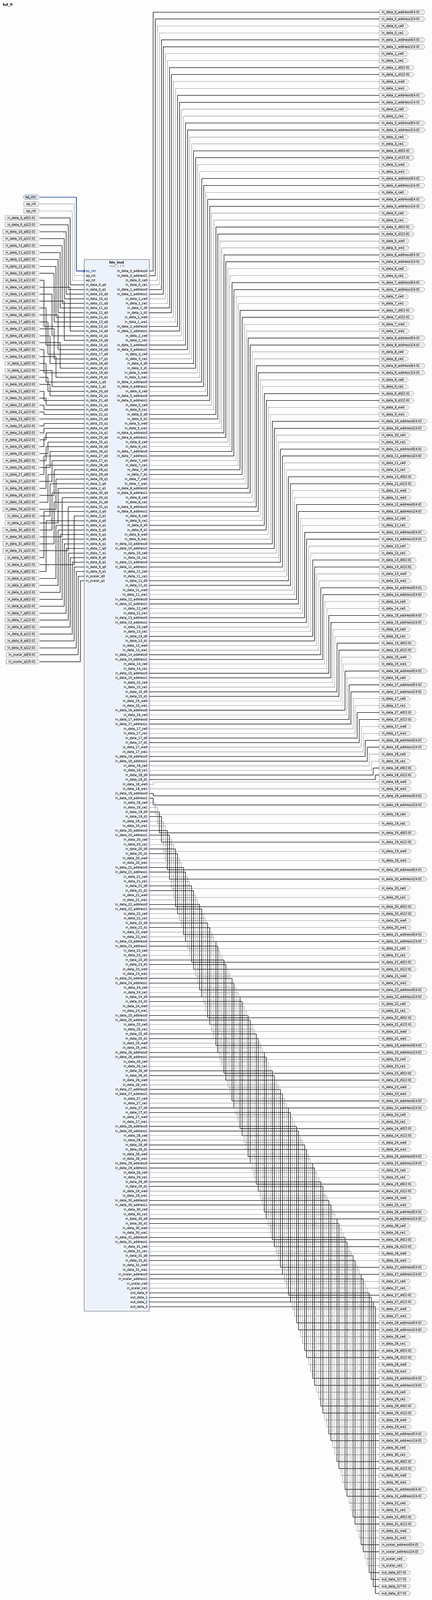
[diagram p0: block diagram of the top level, whole]
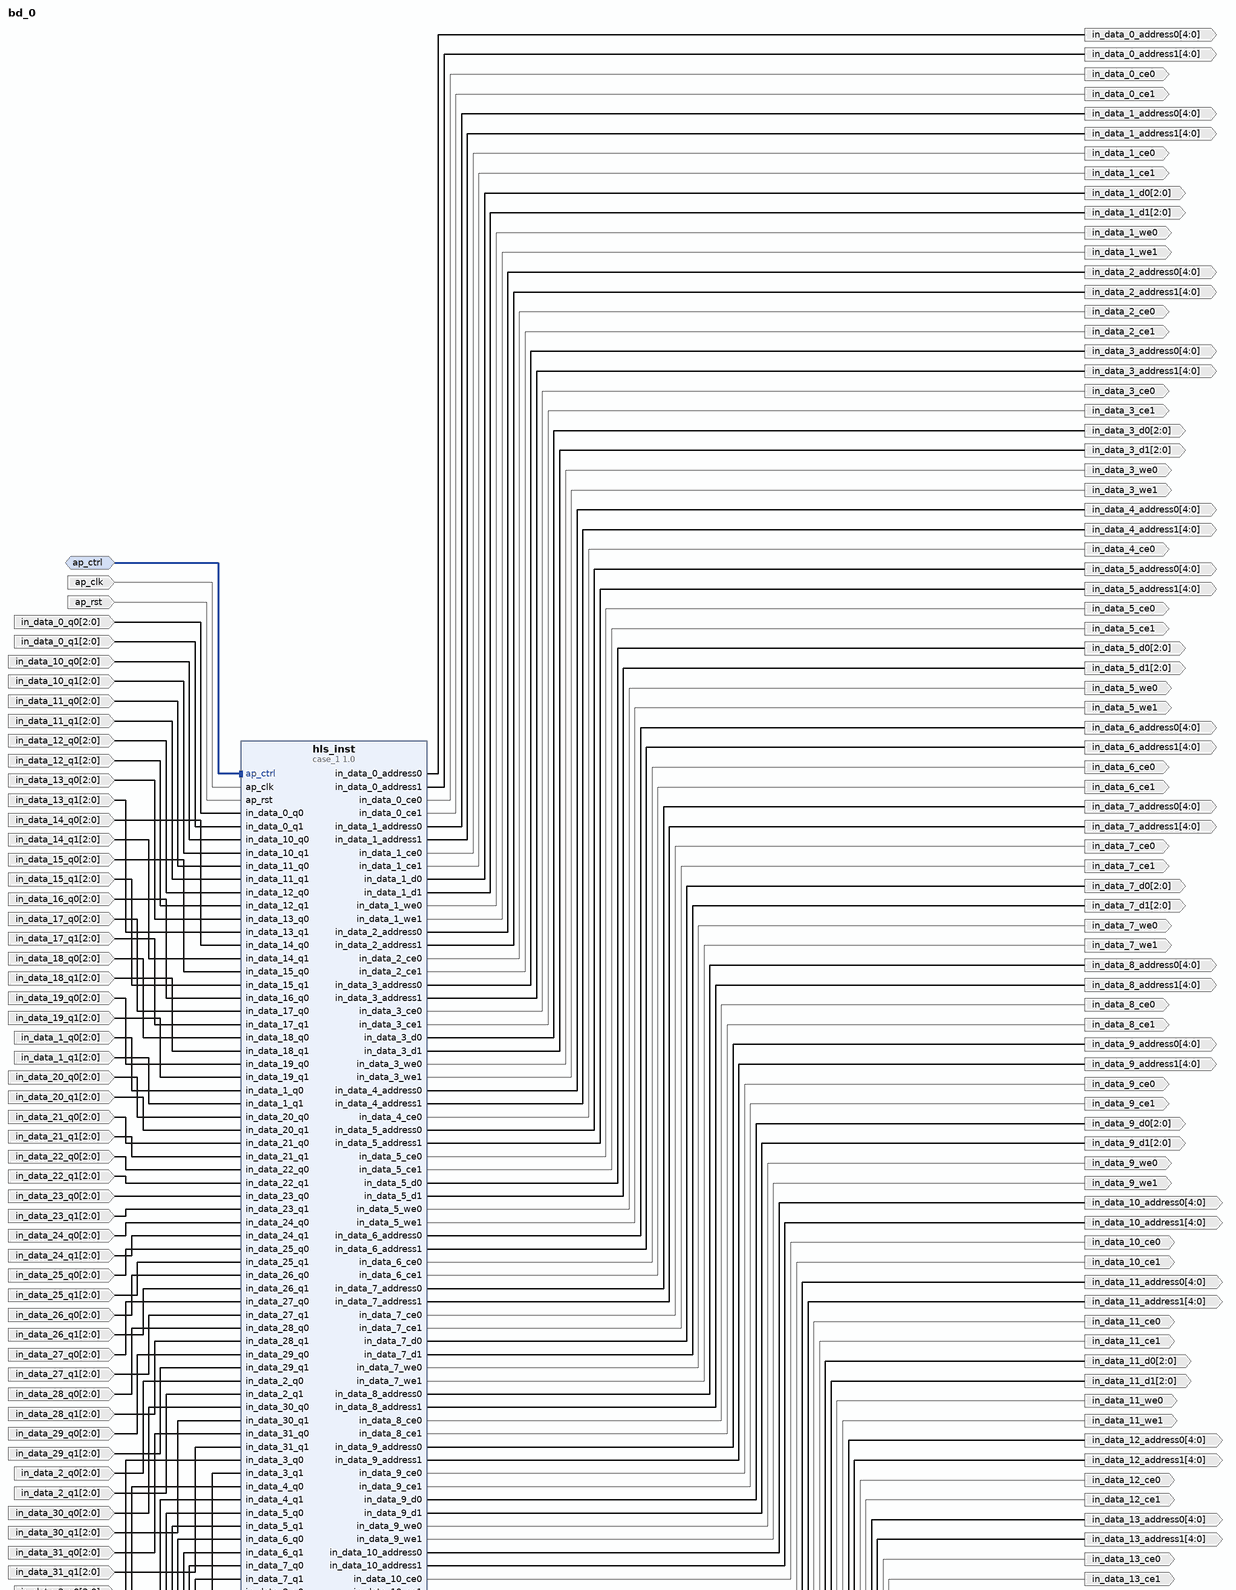
[diagram p1: block diagram of the top level, upper part]
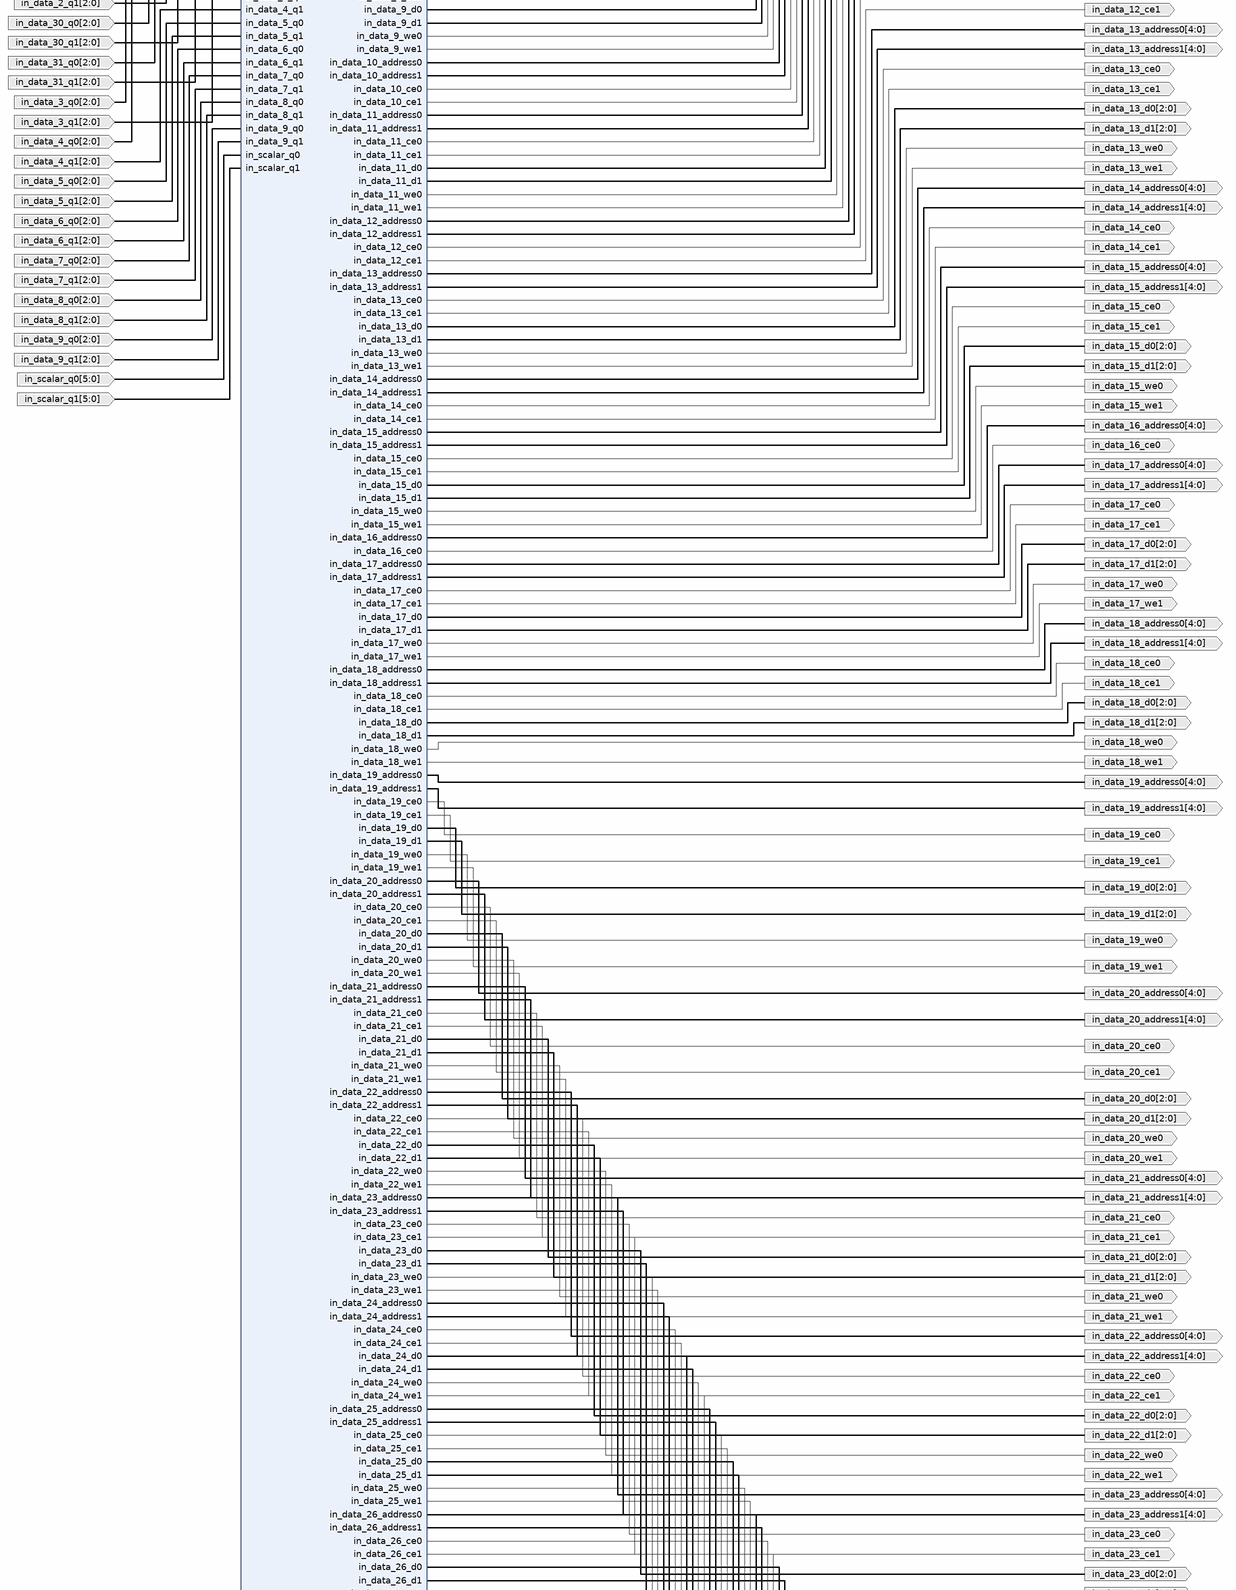
[diagram p2: block diagram of the top level, middle part]
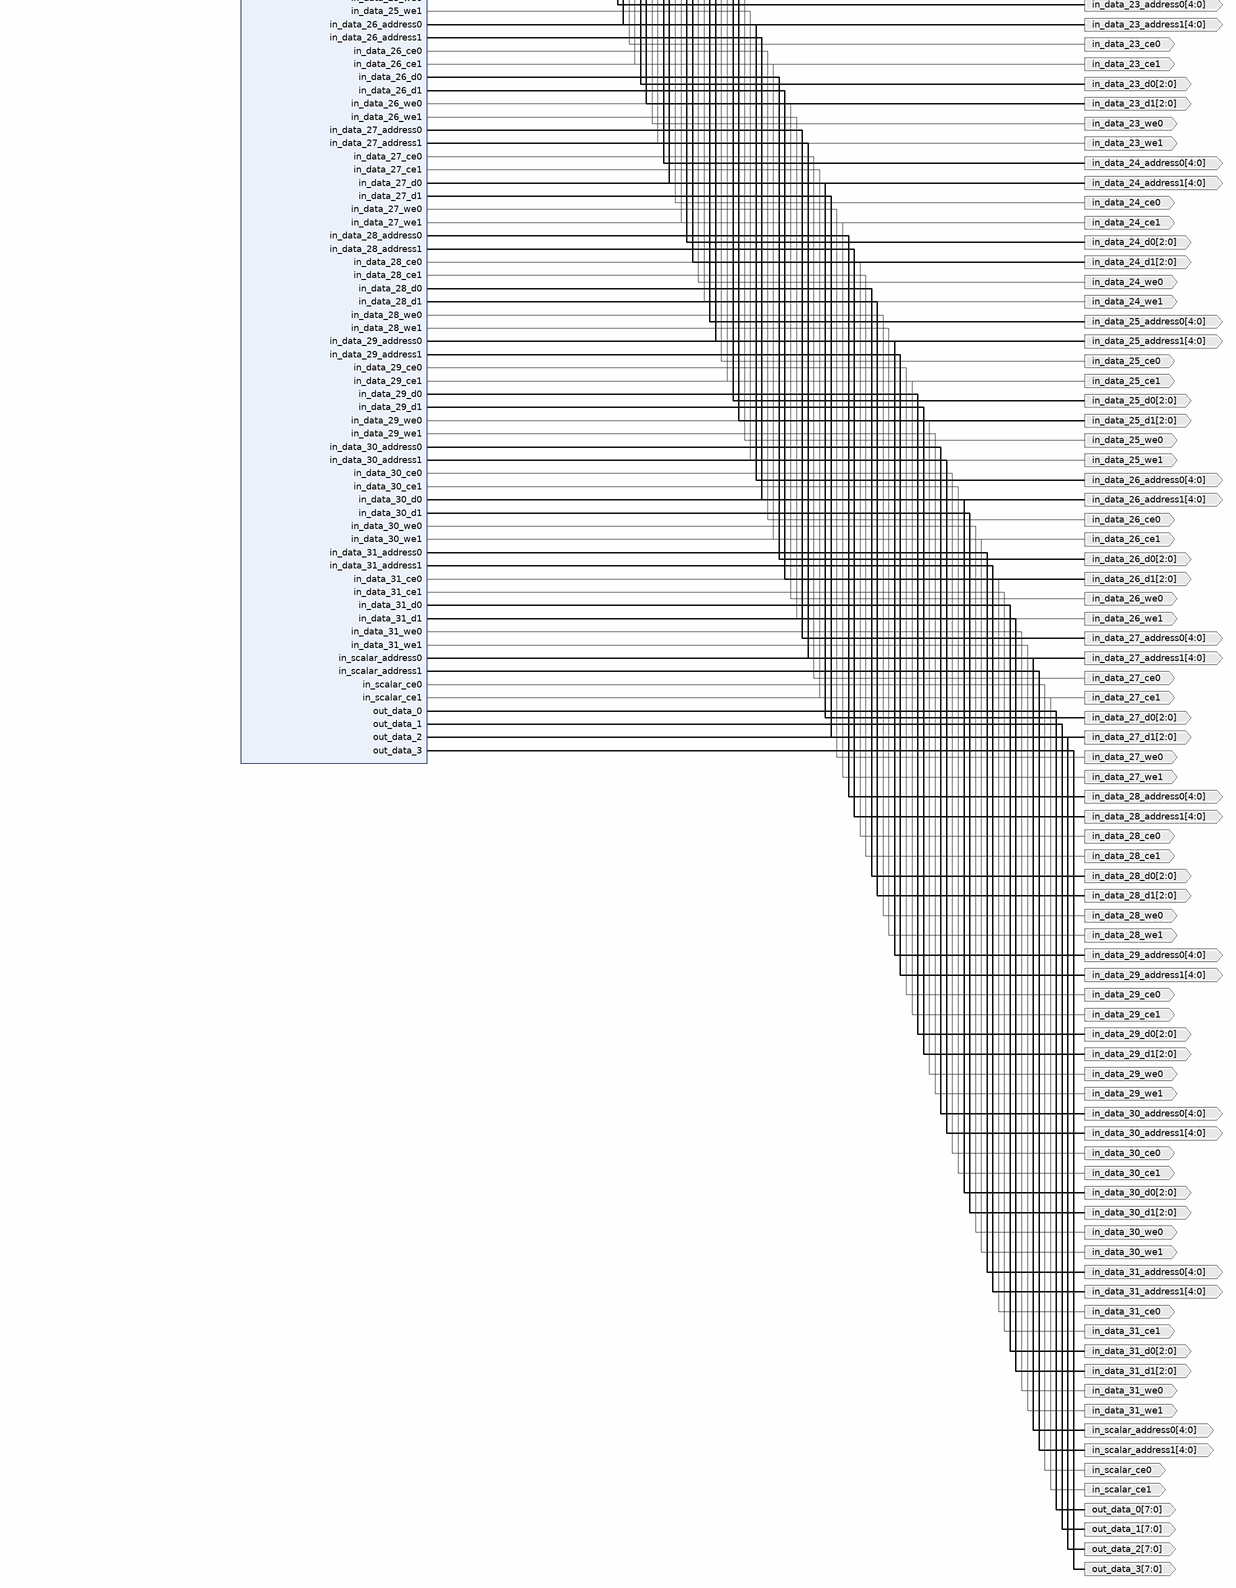
[diagram p3: block diagram of the top level, lower part]
# Vivado block design bd_0, xc7z020clg400-1, Vivado 2025.1
create_bd_design bd_0

create_bd_intf_port -mode Slave -vlnv xilinx.com:interface:acc_handshake_rtl:1.0 ap_ctrl
create_bd_port -dir I -type clk ap_clk
set_property -dict {CONFIG.FREQ_HZ 83000000.0} [get_bd_ports ap_clk]
create_bd_port -dir I -type rst ap_rst
set_property -dict {CONFIG.POLARITY ACTIVE_HIGH} [get_bd_ports ap_rst]
create_bd_port -dir O -from 4 -to 0 -type data in_data_0_address0
create_bd_port -dir O -from 4 -to 0 -type data in_data_0_address1
create_bd_port -dir O in_data_0_ce0
create_bd_port -dir O in_data_0_ce1
create_bd_port -dir I -from 2 -to 0 -type data in_data_0_q0
create_bd_port -dir I -from 2 -to 0 -type data in_data_0_q1
create_bd_port -dir O -from 4 -to 0 -type data in_data_10_address0
create_bd_port -dir O -from 4 -to 0 -type data in_data_10_address1
create_bd_port -dir O in_data_10_ce0
create_bd_port -dir O in_data_10_ce1
create_bd_port -dir I -from 2 -to 0 -type data in_data_10_q0
create_bd_port -dir I -from 2 -to 0 -type data in_data_10_q1
create_bd_port -dir O -from 4 -to 0 -type data in_data_11_address0
create_bd_port -dir O -from 4 -to 0 -type data in_data_11_address1
create_bd_port -dir O in_data_11_ce0
create_bd_port -dir O in_data_11_ce1
create_bd_port -dir O -from 2 -to 0 -type data in_data_11_d0
create_bd_port -dir O -from 2 -to 0 -type data in_data_11_d1
create_bd_port -dir I -from 2 -to 0 -type data in_data_11_q0
create_bd_port -dir I -from 2 -to 0 -type data in_data_11_q1
create_bd_port -dir O in_data_11_we0
create_bd_port -dir O in_data_11_we1
create_bd_port -dir O -from 4 -to 0 -type data in_data_12_address0
create_bd_port -dir O -from 4 -to 0 -type data in_data_12_address1
create_bd_port -dir O in_data_12_ce0
create_bd_port -dir O in_data_12_ce1
create_bd_port -dir I -from 2 -to 0 -type data in_data_12_q0
create_bd_port -dir I -from 2 -to 0 -type data in_data_12_q1
create_bd_port -dir O -from 4 -to 0 -type data in_data_13_address0
create_bd_port -dir O -from 4 -to 0 -type data in_data_13_address1
create_bd_port -dir O in_data_13_ce0
create_bd_port -dir O in_data_13_ce1
create_bd_port -dir O -from 2 -to 0 -type data in_data_13_d0
create_bd_port -dir O -from 2 -to 0 -type data in_data_13_d1
create_bd_port -dir I -from 2 -to 0 -type data in_data_13_q0
create_bd_port -dir I -from 2 -to 0 -type data in_data_13_q1
create_bd_port -dir O in_data_13_we0
create_bd_port -dir O in_data_13_we1
create_bd_port -dir O -from 4 -to 0 -type data in_data_14_address0
create_bd_port -dir O -from 4 -to 0 -type data in_data_14_address1
create_bd_port -dir O in_data_14_ce0
create_bd_port -dir O in_data_14_ce1
create_bd_port -dir I -from 2 -to 0 -type data in_data_14_q0
create_bd_port -dir I -from 2 -to 0 -type data in_data_14_q1
create_bd_port -dir O -from 4 -to 0 -type data in_data_15_address0
create_bd_port -dir O -from 4 -to 0 -type data in_data_15_address1
create_bd_port -dir O in_data_15_ce0
create_bd_port -dir O in_data_15_ce1
create_bd_port -dir O -from 2 -to 0 -type data in_data_15_d0
create_bd_port -dir O -from 2 -to 0 -type data in_data_15_d1
create_bd_port -dir I -from 2 -to 0 -type data in_data_15_q0
create_bd_port -dir I -from 2 -to 0 -type data in_data_15_q1
create_bd_port -dir O in_data_15_we0
create_bd_port -dir O in_data_15_we1
create_bd_port -dir O -from 4 -to 0 -type data in_data_16_address0
create_bd_port -dir O in_data_16_ce0
create_bd_port -dir I -from 2 -to 0 -type data in_data_16_q0
create_bd_port -dir O -from 4 -to 0 -type data in_data_17_address0
create_bd_port -dir O -from 4 -to 0 -type data in_data_17_address1
create_bd_port -dir O in_data_17_ce0
create_bd_port -dir O in_data_17_ce1
create_bd_port -dir O -from 2 -to 0 -type data in_data_17_d0
create_bd_port -dir O -from 2 -to 0 -type data in_data_17_d1
create_bd_port -dir I -from 2 -to 0 -type data in_data_17_q0
create_bd_port -dir I -from 2 -to 0 -type data in_data_17_q1
create_bd_port -dir O in_data_17_we0
create_bd_port -dir O in_data_17_we1
create_bd_port -dir O -from 4 -to 0 -type data in_data_18_address0
create_bd_port -dir O -from 4 -to 0 -type data in_data_18_address1
create_bd_port -dir O in_data_18_ce0
create_bd_port -dir O in_data_18_ce1
create_bd_port -dir O -from 2 -to 0 -type data in_data_18_d0
create_bd_port -dir O -from 2 -to 0 -type data in_data_18_d1
create_bd_port -dir I -from 2 -to 0 -type data in_data_18_q0
create_bd_port -dir I -from 2 -to 0 -type data in_data_18_q1
create_bd_port -dir O in_data_18_we0
create_bd_port -dir O in_data_18_we1
create_bd_port -dir O -from 4 -to 0 -type data in_data_19_address0
create_bd_port -dir O -from 4 -to 0 -type data in_data_19_address1
create_bd_port -dir O in_data_19_ce0
create_bd_port -dir O in_data_19_ce1
create_bd_port -dir O -from 2 -to 0 -type data in_data_19_d0
create_bd_port -dir O -from 2 -to 0 -type data in_data_19_d1
create_bd_port -dir I -from 2 -to 0 -type data in_data_19_q0
create_bd_port -dir I -from 2 -to 0 -type data in_data_19_q1
create_bd_port -dir O in_data_19_we0
create_bd_port -dir O in_data_19_we1
create_bd_port -dir O -from 4 -to 0 -type data in_data_1_address0
create_bd_port -dir O -from 4 -to 0 -type data in_data_1_address1
create_bd_port -dir O in_data_1_ce0
create_bd_port -dir O in_data_1_ce1
create_bd_port -dir O -from 2 -to 0 -type data in_data_1_d0
create_bd_port -dir O -from 2 -to 0 -type data in_data_1_d1
create_bd_port -dir I -from 2 -to 0 -type data in_data_1_q0
create_bd_port -dir I -from 2 -to 0 -type data in_data_1_q1
create_bd_port -dir O in_data_1_we0
create_bd_port -dir O in_data_1_we1
create_bd_port -dir O -from 4 -to 0 -type data in_data_20_address0
create_bd_port -dir O -from 4 -to 0 -type data in_data_20_address1
create_bd_port -dir O in_data_20_ce0
create_bd_port -dir O in_data_20_ce1
create_bd_port -dir O -from 2 -to 0 -type data in_data_20_d0
create_bd_port -dir O -from 2 -to 0 -type data in_data_20_d1
create_bd_port -dir I -from 2 -to 0 -type data in_data_20_q0
create_bd_port -dir I -from 2 -to 0 -type data in_data_20_q1
create_bd_port -dir O in_data_20_we0
create_bd_port -dir O in_data_20_we1
create_bd_port -dir O -from 4 -to 0 -type data in_data_21_address0
create_bd_port -dir O -from 4 -to 0 -type data in_data_21_address1
create_bd_port -dir O in_data_21_ce0
create_bd_port -dir O in_data_21_ce1
create_bd_port -dir O -from 2 -to 0 -type data in_data_21_d0
create_bd_port -dir O -from 2 -to 0 -type data in_data_21_d1
create_bd_port -dir I -from 2 -to 0 -type data in_data_21_q0
create_bd_port -dir I -from 2 -to 0 -type data in_data_21_q1
create_bd_port -dir O in_data_21_we0
create_bd_port -dir O in_data_21_we1
create_bd_port -dir O -from 4 -to 0 -type data in_data_22_address0
create_bd_port -dir O -from 4 -to 0 -type data in_data_22_address1
create_bd_port -dir O in_data_22_ce0
create_bd_port -dir O in_data_22_ce1
create_bd_port -dir O -from 2 -to 0 -type data in_data_22_d0
create_bd_port -dir O -from 2 -to 0 -type data in_data_22_d1
create_bd_port -dir I -from 2 -to 0 -type data in_data_22_q0
create_bd_port -dir I -from 2 -to 0 -type data in_data_22_q1
create_bd_port -dir O in_data_22_we0
create_bd_port -dir O in_data_22_we1
create_bd_port -dir O -from 4 -to 0 -type data in_data_23_address0
create_bd_port -dir O -from 4 -to 0 -type data in_data_23_address1
create_bd_port -dir O in_data_23_ce0
create_bd_port -dir O in_data_23_ce1
create_bd_port -dir O -from 2 -to 0 -type data in_data_23_d0
create_bd_port -dir O -from 2 -to 0 -type data in_data_23_d1
create_bd_port -dir I -from 2 -to 0 -type data in_data_23_q0
create_bd_port -dir I -from 2 -to 0 -type data in_data_23_q1
create_bd_port -dir O in_data_23_we0
create_bd_port -dir O in_data_23_we1
create_bd_port -dir O -from 4 -to 0 -type data in_data_24_address0
create_bd_port -dir O -from 4 -to 0 -type data in_data_24_address1
create_bd_port -dir O in_data_24_ce0
create_bd_port -dir O in_data_24_ce1
create_bd_port -dir O -from 2 -to 0 -type data in_data_24_d0
create_bd_port -dir O -from 2 -to 0 -type data in_data_24_d1
create_bd_port -dir I -from 2 -to 0 -type data in_data_24_q0
create_bd_port -dir I -from 2 -to 0 -type data in_data_24_q1
create_bd_port -dir O in_data_24_we0
create_bd_port -dir O in_data_24_we1
create_bd_port -dir O -from 4 -to 0 -type data in_data_25_address0
create_bd_port -dir O -from 4 -to 0 -type data in_data_25_address1
create_bd_port -dir O in_data_25_ce0
create_bd_port -dir O in_data_25_ce1
create_bd_port -dir O -from 2 -to 0 -type data in_data_25_d0
create_bd_port -dir O -from 2 -to 0 -type data in_data_25_d1
create_bd_port -dir I -from 2 -to 0 -type data in_data_25_q0
create_bd_port -dir I -from 2 -to 0 -type data in_data_25_q1
create_bd_port -dir O in_data_25_we0
create_bd_port -dir O in_data_25_we1
create_bd_port -dir O -from 4 -to 0 -type data in_data_26_address0
create_bd_port -dir O -from 4 -to 0 -type data in_data_26_address1
create_bd_port -dir O in_data_26_ce0
create_bd_port -dir O in_data_26_ce1
create_bd_port -dir O -from 2 -to 0 -type data in_data_26_d0
create_bd_port -dir O -from 2 -to 0 -type data in_data_26_d1
create_bd_port -dir I -from 2 -to 0 -type data in_data_26_q0
create_bd_port -dir I -from 2 -to 0 -type data in_data_26_q1
create_bd_port -dir O in_data_26_we0
create_bd_port -dir O in_data_26_we1
create_bd_port -dir O -from 4 -to 0 -type data in_data_27_address0
create_bd_port -dir O -from 4 -to 0 -type data in_data_27_address1
create_bd_port -dir O in_data_27_ce0
create_bd_port -dir O in_data_27_ce1
create_bd_port -dir O -from 2 -to 0 -type data in_data_27_d0
create_bd_port -dir O -from 2 -to 0 -type data in_data_27_d1
create_bd_port -dir I -from 2 -to 0 -type data in_data_27_q0
create_bd_port -dir I -from 2 -to 0 -type data in_data_27_q1
create_bd_port -dir O in_data_27_we0
create_bd_port -dir O in_data_27_we1
create_bd_port -dir O -from 4 -to 0 -type data in_data_28_address0
create_bd_port -dir O -from 4 -to 0 -type data in_data_28_address1
create_bd_port -dir O in_data_28_ce0
create_bd_port -dir O in_data_28_ce1
create_bd_port -dir O -from 2 -to 0 -type data in_data_28_d0
create_bd_port -dir O -from 2 -to 0 -type data in_data_28_d1
create_bd_port -dir I -from 2 -to 0 -type data in_data_28_q0
create_bd_port -dir I -from 2 -to 0 -type data in_data_28_q1
create_bd_port -dir O in_data_28_we0
create_bd_port -dir O in_data_28_we1
create_bd_port -dir O -from 4 -to 0 -type data in_data_29_address0
create_bd_port -dir O -from 4 -to 0 -type data in_data_29_address1
create_bd_port -dir O in_data_29_ce0
create_bd_port -dir O in_data_29_ce1
create_bd_port -dir O -from 2 -to 0 -type data in_data_29_d0
create_bd_port -dir O -from 2 -to 0 -type data in_data_29_d1
create_bd_port -dir I -from 2 -to 0 -type data in_data_29_q0
create_bd_port -dir I -from 2 -to 0 -type data in_data_29_q1
create_bd_port -dir O in_data_29_we0
create_bd_port -dir O in_data_29_we1
create_bd_port -dir O -from 4 -to 0 -type data in_data_2_address0
create_bd_port -dir O -from 4 -to 0 -type data in_data_2_address1
create_bd_port -dir O in_data_2_ce0
create_bd_port -dir O in_data_2_ce1
create_bd_port -dir I -from 2 -to 0 -type data in_data_2_q0
create_bd_port -dir I -from 2 -to 0 -type data in_data_2_q1
create_bd_port -dir O -from 4 -to 0 -type data in_data_30_address0
create_bd_port -dir O -from 4 -to 0 -type data in_data_30_address1
create_bd_port -dir O in_data_30_ce0
create_bd_port -dir O in_data_30_ce1
create_bd_port -dir O -from 2 -to 0 -type data in_data_30_d0
create_bd_port -dir O -from 2 -to 0 -type data in_data_30_d1
create_bd_port -dir I -from 2 -to 0 -type data in_data_30_q0
create_bd_port -dir I -from 2 -to 0 -type data in_data_30_q1
create_bd_port -dir O in_data_30_we0
create_bd_port -dir O in_data_30_we1
create_bd_port -dir O -from 4 -to 0 -type data in_data_31_address0
create_bd_port -dir O -from 4 -to 0 -type data in_data_31_address1
create_bd_port -dir O in_data_31_ce0
create_bd_port -dir O in_data_31_ce1
create_bd_port -dir O -from 2 -to 0 -type data in_data_31_d0
create_bd_port -dir O -from 2 -to 0 -type data in_data_31_d1
create_bd_port -dir I -from 2 -to 0 -type data in_data_31_q0
create_bd_port -dir I -from 2 -to 0 -type data in_data_31_q1
create_bd_port -dir O in_data_31_we0
create_bd_port -dir O in_data_31_we1
create_bd_port -dir O -from 4 -to 0 -type data in_data_3_address0
create_bd_port -dir O -from 4 -to 0 -type data in_data_3_address1
create_bd_port -dir O in_data_3_ce0
create_bd_port -dir O in_data_3_ce1
create_bd_port -dir O -from 2 -to 0 -type data in_data_3_d0
create_bd_port -dir O -from 2 -to 0 -type data in_data_3_d1
create_bd_port -dir I -from 2 -to 0 -type data in_data_3_q0
create_bd_port -dir I -from 2 -to 0 -type data in_data_3_q1
create_bd_port -dir O in_data_3_we0
create_bd_port -dir O in_data_3_we1
create_bd_port -dir O -from 4 -to 0 -type data in_data_4_address0
create_bd_port -dir O -from 4 -to 0 -type data in_data_4_address1
create_bd_port -dir O in_data_4_ce0
create_bd_port -dir I -from 2 -to 0 -type data in_data_4_q0
create_bd_port -dir I -from 2 -to 0 -type data in_data_4_q1
create_bd_port -dir O -from 4 -to 0 -type data in_data_5_address0
create_bd_port -dir O -from 4 -to 0 -type data in_data_5_address1
create_bd_port -dir O in_data_5_ce0
create_bd_port -dir O in_data_5_ce1
create_bd_port -dir O -from 2 -to 0 -type data in_data_5_d0
create_bd_port -dir O -from 2 -to 0 -type data in_data_5_d1
create_bd_port -dir I -from 2 -to 0 -type data in_data_5_q0
create_bd_port -dir I -from 2 -to 0 -type data in_data_5_q1
create_bd_port -dir O in_data_5_we0
create_bd_port -dir O in_data_5_we1
create_bd_port -dir O -from 4 -to 0 -type data in_data_6_address0
create_bd_port -dir O -from 4 -to 0 -type data in_data_6_address1
create_bd_port -dir O in_data_6_ce0
create_bd_port -dir O in_data_6_ce1
create_bd_port -dir I -from 2 -to 0 -type data in_data_6_q0
create_bd_port -dir I -from 2 -to 0 -type data in_data_6_q1
create_bd_port -dir O -from 4 -to 0 -type data in_data_7_address0
create_bd_port -dir O -from 4 -to 0 -type data in_data_7_address1
create_bd_port -dir O in_data_7_ce0
create_bd_port -dir O in_data_7_ce1
create_bd_port -dir O -from 2 -to 0 -type data in_data_7_d0
create_bd_port -dir O -from 2 -to 0 -type data in_data_7_d1
create_bd_port -dir I -from 2 -to 0 -type data in_data_7_q0
create_bd_port -dir I -from 2 -to 0 -type data in_data_7_q1
create_bd_port -dir O in_data_7_we0
create_bd_port -dir O in_data_7_we1
create_bd_port -dir O -from 4 -to 0 -type data in_data_8_address0
create_bd_port -dir O -from 4 -to 0 -type data in_data_8_address1
create_bd_port -dir O in_data_8_ce0
create_bd_port -dir O in_data_8_ce1
create_bd_port -dir I -from 2 -to 0 -type data in_data_8_q0
create_bd_port -dir I -from 2 -to 0 -type data in_data_8_q1
create_bd_port -dir O -from 4 -to 0 -type data in_data_9_address0
create_bd_port -dir O -from 4 -to 0 -type data in_data_9_address1
create_bd_port -dir O in_data_9_ce0
create_bd_port -dir O in_data_9_ce1
create_bd_port -dir O -from 2 -to 0 -type data in_data_9_d0
create_bd_port -dir O -from 2 -to 0 -type data in_data_9_d1
create_bd_port -dir I -from 2 -to 0 -type data in_data_9_q0
create_bd_port -dir I -from 2 -to 0 -type data in_data_9_q1
create_bd_port -dir O in_data_9_we0
create_bd_port -dir O in_data_9_we1
create_bd_port -dir O -from 4 -to 0 -type data in_scalar_address0
create_bd_port -dir O -from 4 -to 0 -type data in_scalar_address1
create_bd_port -dir O in_scalar_ce0
create_bd_port -dir O in_scalar_ce1
create_bd_port -dir I -from 5 -to 0 -type data in_scalar_q0
create_bd_port -dir I -from 5 -to 0 -type data in_scalar_q1
create_bd_port -dir O -from 7 -to 0 -type data out_data_0
create_bd_port -dir O -from 7 -to 0 -type data out_data_1
create_bd_port -dir O -from 7 -to 0 -type data out_data_2
create_bd_port -dir O -from 7 -to 0 -type data out_data_3

create_bd_cell -type ip -vlnv xilinx.com:hls:case_1:1.0 hls_inst

# ---- connections ----

connect_bd_intf_net -intf_net ap_ctrl_0_1 [get_bd_intf_ports ap_ctrl] [get_bd_intf_pins hls_inst/ap_ctrl]
connect_bd_net -net ap_clk_0_1 [get_bd_ports ap_clk] [get_bd_pins hls_inst/ap_clk]
connect_bd_net -net ap_rst_0_1 [get_bd_ports ap_rst] [get_bd_pins hls_inst/ap_rst]
connect_bd_net [get_bd_pins hls_inst/in_data_0_address0] [get_bd_ports in_data_0_address0]
connect_bd_net [get_bd_pins hls_inst/in_data_0_address1] [get_bd_ports in_data_0_address1]
connect_bd_net [get_bd_pins hls_inst/in_data_0_ce0] [get_bd_ports in_data_0_ce0]
connect_bd_net [get_bd_pins hls_inst/in_data_0_ce1] [get_bd_ports in_data_0_ce1]
connect_bd_net [get_bd_pins hls_inst/in_data_10_address0] [get_bd_ports in_data_10_address0]
connect_bd_net [get_bd_pins hls_inst/in_data_10_address1] [get_bd_ports in_data_10_address1]
connect_bd_net [get_bd_pins hls_inst/in_data_10_ce0] [get_bd_ports in_data_10_ce0]
connect_bd_net [get_bd_pins hls_inst/in_data_10_ce1] [get_bd_ports in_data_10_ce1]
connect_bd_net [get_bd_pins hls_inst/in_data_11_address0] [get_bd_ports in_data_11_address0]
connect_bd_net [get_bd_pins hls_inst/in_data_11_address1] [get_bd_ports in_data_11_address1]
connect_bd_net [get_bd_pins hls_inst/in_data_11_ce0] [get_bd_ports in_data_11_ce0]
connect_bd_net [get_bd_pins hls_inst/in_data_11_ce1] [get_bd_ports in_data_11_ce1]
connect_bd_net [get_bd_pins hls_inst/in_data_11_d0] [get_bd_ports in_data_11_d0]
connect_bd_net [get_bd_pins hls_inst/in_data_11_d1] [get_bd_ports in_data_11_d1]
connect_bd_net [get_bd_pins hls_inst/in_data_11_we0] [get_bd_ports in_data_11_we0]
connect_bd_net [get_bd_pins hls_inst/in_data_11_we1] [get_bd_ports in_data_11_we1]
connect_bd_net [get_bd_pins hls_inst/in_data_12_address0] [get_bd_ports in_data_12_address0]
connect_bd_net [get_bd_pins hls_inst/in_data_12_address1] [get_bd_ports in_data_12_address1]
connect_bd_net [get_bd_pins hls_inst/in_data_12_ce0] [get_bd_ports in_data_12_ce0]
connect_bd_net [get_bd_pins hls_inst/in_data_12_ce1] [get_bd_ports in_data_12_ce1]
connect_bd_net [get_bd_pins hls_inst/in_data_13_address0] [get_bd_ports in_data_13_address0]
connect_bd_net [get_bd_pins hls_inst/in_data_13_address1] [get_bd_ports in_data_13_address1]
connect_bd_net [get_bd_pins hls_inst/in_data_13_ce0] [get_bd_ports in_data_13_ce0]
connect_bd_net [get_bd_pins hls_inst/in_data_13_ce1] [get_bd_ports in_data_13_ce1]
connect_bd_net [get_bd_pins hls_inst/in_data_13_d0] [get_bd_ports in_data_13_d0]
connect_bd_net [get_bd_pins hls_inst/in_data_13_d1] [get_bd_ports in_data_13_d1]
connect_bd_net [get_bd_pins hls_inst/in_data_13_we0] [get_bd_ports in_data_13_we0]
connect_bd_net [get_bd_pins hls_inst/in_data_13_we1] [get_bd_ports in_data_13_we1]
connect_bd_net [get_bd_pins hls_inst/in_data_14_address0] [get_bd_ports in_data_14_address0]
connect_bd_net [get_bd_pins hls_inst/in_data_14_address1] [get_bd_ports in_data_14_address1]
connect_bd_net [get_bd_pins hls_inst/in_data_14_ce0] [get_bd_ports in_data_14_ce0]
connect_bd_net [get_bd_pins hls_inst/in_data_14_ce1] [get_bd_ports in_data_14_ce1]
connect_bd_net [get_bd_pins hls_inst/in_data_15_address0] [get_bd_ports in_data_15_address0]
connect_bd_net [get_bd_pins hls_inst/in_data_15_address1] [get_bd_ports in_data_15_address1]
connect_bd_net [get_bd_pins hls_inst/in_data_15_ce0] [get_bd_ports in_data_15_ce0]
connect_bd_net [get_bd_pins hls_inst/in_data_15_ce1] [get_bd_ports in_data_15_ce1]
connect_bd_net [get_bd_pins hls_inst/in_data_15_d0] [get_bd_ports in_data_15_d0]
connect_bd_net [get_bd_pins hls_inst/in_data_15_d1] [get_bd_ports in_data_15_d1]
connect_bd_net [get_bd_pins hls_inst/in_data_15_we0] [get_bd_ports in_data_15_we0]
connect_bd_net [get_bd_pins hls_inst/in_data_15_we1] [get_bd_ports in_data_15_we1]
connect_bd_net [get_bd_pins hls_inst/in_data_16_address0] [get_bd_ports in_data_16_address0]
connect_bd_net [get_bd_pins hls_inst/in_data_16_ce0] [get_bd_ports in_data_16_ce0]
connect_bd_net [get_bd_pins hls_inst/in_data_17_address0] [get_bd_ports in_data_17_address0]
connect_bd_net [get_bd_pins hls_inst/in_data_17_address1] [get_bd_ports in_data_17_address1]
connect_bd_net [get_bd_pins hls_inst/in_data_17_ce0] [get_bd_ports in_data_17_ce0]
connect_bd_net [get_bd_pins hls_inst/in_data_17_ce1] [get_bd_ports in_data_17_ce1]
connect_bd_net [get_bd_pins hls_inst/in_data_17_d0] [get_bd_ports in_data_17_d0]
connect_bd_net [get_bd_pins hls_inst/in_data_17_d1] [get_bd_ports in_data_17_d1]
connect_bd_net [get_bd_pins hls_inst/in_data_17_we0] [get_bd_ports in_data_17_we0]
connect_bd_net [get_bd_pins hls_inst/in_data_17_we1] [get_bd_ports in_data_17_we1]
connect_bd_net [get_bd_pins hls_inst/in_data_18_address0] [get_bd_ports in_data_18_address0]
connect_bd_net [get_bd_pins hls_inst/in_data_18_address1] [get_bd_ports in_data_18_address1]
connect_bd_net [get_bd_pins hls_inst/in_data_18_ce0] [get_bd_ports in_data_18_ce0]
connect_bd_net [get_bd_pins hls_inst/in_data_18_ce1] [get_bd_ports in_data_18_ce1]
connect_bd_net [get_bd_pins hls_inst/in_data_18_d0] [get_bd_ports in_data_18_d0]
connect_bd_net [get_bd_pins hls_inst/in_data_18_d1] [get_bd_ports in_data_18_d1]
connect_bd_net [get_bd_pins hls_inst/in_data_18_we0] [get_bd_ports in_data_18_we0]
connect_bd_net [get_bd_pins hls_inst/in_data_18_we1] [get_bd_ports in_data_18_we1]
connect_bd_net [get_bd_pins hls_inst/in_data_19_address0] [get_bd_ports in_data_19_address0]
connect_bd_net [get_bd_pins hls_inst/in_data_19_address1] [get_bd_ports in_data_19_address1]
connect_bd_net [get_bd_pins hls_inst/in_data_19_ce0] [get_bd_ports in_data_19_ce0]
connect_bd_net [get_bd_pins hls_inst/in_data_19_ce1] [get_bd_ports in_data_19_ce1]
connect_bd_net [get_bd_pins hls_inst/in_data_19_d0] [get_bd_ports in_data_19_d0]
connect_bd_net [get_bd_pins hls_inst/in_data_19_d1] [get_bd_ports in_data_19_d1]
connect_bd_net [get_bd_pins hls_inst/in_data_19_we0] [get_bd_ports in_data_19_we0]
connect_bd_net [get_bd_pins hls_inst/in_data_19_we1] [get_bd_ports in_data_19_we1]
connect_bd_net [get_bd_pins hls_inst/in_data_1_address0] [get_bd_ports in_data_1_address0]
connect_bd_net [get_bd_pins hls_inst/in_data_1_address1] [get_bd_ports in_data_1_address1]
connect_bd_net [get_bd_pins hls_inst/in_data_1_ce0] [get_bd_ports in_data_1_ce0]
connect_bd_net [get_bd_pins hls_inst/in_data_1_ce1] [get_bd_ports in_data_1_ce1]
connect_bd_net [get_bd_pins hls_inst/in_data_1_d0] [get_bd_ports in_data_1_d0]
connect_bd_net [get_bd_pins hls_inst/in_data_1_d1] [get_bd_ports in_data_1_d1]
connect_bd_net [get_bd_pins hls_inst/in_data_1_we0] [get_bd_ports in_data_1_we0]
connect_bd_net [get_bd_pins hls_inst/in_data_1_we1] [get_bd_ports in_data_1_we1]
connect_bd_net [get_bd_pins hls_inst/in_data_20_address0] [get_bd_ports in_data_20_address0]
connect_bd_net [get_bd_pins hls_inst/in_data_20_address1] [get_bd_ports in_data_20_address1]
connect_bd_net [get_bd_pins hls_inst/in_data_20_ce0] [get_bd_ports in_data_20_ce0]
connect_bd_net [get_bd_pins hls_inst/in_data_20_ce1] [get_bd_ports in_data_20_ce1]
connect_bd_net [get_bd_pins hls_inst/in_data_20_d0] [get_bd_ports in_data_20_d0]
connect_bd_net [get_bd_pins hls_inst/in_data_20_d1] [get_bd_ports in_data_20_d1]
connect_bd_net [get_bd_pins hls_inst/in_data_20_we0] [get_bd_ports in_data_20_we0]
connect_bd_net [get_bd_pins hls_inst/in_data_20_we1] [get_bd_ports in_data_20_we1]
connect_bd_net [get_bd_pins hls_inst/in_data_21_address0] [get_bd_ports in_data_21_address0]
connect_bd_net [get_bd_pins hls_inst/in_data_21_address1] [get_bd_ports in_data_21_address1]
connect_bd_net [get_bd_pins hls_inst/in_data_21_ce0] [get_bd_ports in_data_21_ce0]
connect_bd_net [get_bd_pins hls_inst/in_data_21_ce1] [get_bd_ports in_data_21_ce1]
connect_bd_net [get_bd_pins hls_inst/in_data_21_d0] [get_bd_ports in_data_21_d0]
connect_bd_net [get_bd_pins hls_inst/in_data_21_d1] [get_bd_ports in_data_21_d1]
connect_bd_net [get_bd_pins hls_inst/in_data_21_we0] [get_bd_ports in_data_21_we0]
connect_bd_net [get_bd_pins hls_inst/in_data_21_we1] [get_bd_ports in_data_21_we1]
connect_bd_net [get_bd_pins hls_inst/in_data_22_address0] [get_bd_ports in_data_22_address0]
connect_bd_net [get_bd_pins hls_inst/in_data_22_address1] [get_bd_ports in_data_22_address1]
connect_bd_net [get_bd_pins hls_inst/in_data_22_ce0] [get_bd_ports in_data_22_ce0]
connect_bd_net [get_bd_pins hls_inst/in_data_22_ce1] [get_bd_ports in_data_22_ce1]
connect_bd_net [get_bd_pins hls_inst/in_data_22_d0] [get_bd_ports in_data_22_d0]
connect_bd_net [get_bd_pins hls_inst/in_data_22_d1] [get_bd_ports in_data_22_d1]
connect_bd_net [get_bd_pins hls_inst/in_data_22_we0] [get_bd_ports in_data_22_we0]
connect_bd_net [get_bd_pins hls_inst/in_data_22_we1] [get_bd_ports in_data_22_we1]
connect_bd_net [get_bd_pins hls_inst/in_data_23_address0] [get_bd_ports in_data_23_address0]
connect_bd_net [get_bd_pins hls_inst/in_data_23_address1] [get_bd_ports in_data_23_address1]
connect_bd_net [get_bd_pins hls_inst/in_data_23_ce0] [get_bd_ports in_data_23_ce0]
connect_bd_net [get_bd_pins hls_inst/in_data_23_ce1] [get_bd_ports in_data_23_ce1]
connect_bd_net [get_bd_pins hls_inst/in_data_23_d0] [get_bd_ports in_data_23_d0]
connect_bd_net [get_bd_pins hls_inst/in_data_23_d1] [get_bd_ports in_data_23_d1]
connect_bd_net [get_bd_pins hls_inst/in_data_23_we0] [get_bd_ports in_data_23_we0]
connect_bd_net [get_bd_pins hls_inst/in_data_23_we1] [get_bd_ports in_data_23_we1]
connect_bd_net [get_bd_pins hls_inst/in_data_24_address0] [get_bd_ports in_data_24_address0]
connect_bd_net [get_bd_pins hls_inst/in_data_24_address1] [get_bd_ports in_data_24_address1]
connect_bd_net [get_bd_pins hls_inst/in_data_24_ce0] [get_bd_ports in_data_24_ce0]
connect_bd_net [get_bd_pins hls_inst/in_data_24_ce1] [get_bd_ports in_data_24_ce1]
connect_bd_net [get_bd_pins hls_inst/in_data_24_d0] [get_bd_ports in_data_24_d0]
connect_bd_net [get_bd_pins hls_inst/in_data_24_d1] [get_bd_ports in_data_24_d1]
connect_bd_net [get_bd_pins hls_inst/in_data_24_we0] [get_bd_ports in_data_24_we0]
connect_bd_net [get_bd_pins hls_inst/in_data_24_we1] [get_bd_ports in_data_24_we1]
connect_bd_net [get_bd_pins hls_inst/in_data_25_address0] [get_bd_ports in_data_25_address0]
connect_bd_net [get_bd_pins hls_inst/in_data_25_address1] [get_bd_ports in_data_25_address1]
connect_bd_net [get_bd_pins hls_inst/in_data_25_ce0] [get_bd_ports in_data_25_ce0]
connect_bd_net [get_bd_pins hls_inst/in_data_25_ce1] [get_bd_ports in_data_25_ce1]
connect_bd_net [get_bd_pins hls_inst/in_data_25_d0] [get_bd_ports in_data_25_d0]
connect_bd_net [get_bd_pins hls_inst/in_data_25_d1] [get_bd_ports in_data_25_d1]
connect_bd_net [get_bd_pins hls_inst/in_data_25_we0] [get_bd_ports in_data_25_we0]
connect_bd_net [get_bd_pins hls_inst/in_data_25_we1] [get_bd_ports in_data_25_we1]
connect_bd_net [get_bd_pins hls_inst/in_data_26_address0] [get_bd_ports in_data_26_address0]
connect_bd_net [get_bd_pins hls_inst/in_data_26_address1] [get_bd_ports in_data_26_address1]
connect_bd_net [get_bd_pins hls_inst/in_data_26_ce0] [get_bd_ports in_data_26_ce0]
connect_bd_net [get_bd_pins hls_inst/in_data_26_ce1] [get_bd_ports in_data_26_ce1]
connect_bd_net [get_bd_pins hls_inst/in_data_26_d0] [get_bd_ports in_data_26_d0]
connect_bd_net [get_bd_pins hls_inst/in_data_26_d1] [get_bd_ports in_data_26_d1]
connect_bd_net [get_bd_pins hls_inst/in_data_26_we0] [get_bd_ports in_data_26_we0]
connect_bd_net [get_bd_pins hls_inst/in_data_26_we1] [get_bd_ports in_data_26_we1]
connect_bd_net [get_bd_pins hls_inst/in_data_27_address0] [get_bd_ports in_data_27_address0]
connect_bd_net [get_bd_pins hls_inst/in_data_27_address1] [get_bd_ports in_data_27_address1]
connect_bd_net [get_bd_pins hls_inst/in_data_27_ce0] [get_bd_ports in_data_27_ce0]
connect_bd_net [get_bd_pins hls_inst/in_data_27_ce1] [get_bd_ports in_data_27_ce1]
connect_bd_net [get_bd_pins hls_inst/in_data_27_d0] [get_bd_ports in_data_27_d0]
connect_bd_net [get_bd_pins hls_inst/in_data_27_d1] [get_bd_ports in_data_27_d1]
connect_bd_net [get_bd_pins hls_inst/in_data_27_we0] [get_bd_ports in_data_27_we0]
connect_bd_net [get_bd_pins hls_inst/in_data_27_we1] [get_bd_ports in_data_27_we1]
connect_bd_net [get_bd_pins hls_inst/in_data_28_address0] [get_bd_ports in_data_28_address0]
connect_bd_net [get_bd_pins hls_inst/in_data_28_address1] [get_bd_ports in_data_28_address1]
connect_bd_net [get_bd_pins hls_inst/in_data_28_ce0] [get_bd_ports in_data_28_ce0]
connect_bd_net [get_bd_pins hls_inst/in_data_28_ce1] [get_bd_ports in_data_28_ce1]
connect_bd_net [get_bd_pins hls_inst/in_data_28_d0] [get_bd_ports in_data_28_d0]
connect_bd_net [get_bd_pins hls_inst/in_data_28_d1] [get_bd_ports in_data_28_d1]
connect_bd_net [get_bd_pins hls_inst/in_data_28_we0] [get_bd_ports in_data_28_we0]
connect_bd_net [get_bd_pins hls_inst/in_data_28_we1] [get_bd_ports in_data_28_we1]
connect_bd_net [get_bd_pins hls_inst/in_data_29_address0] [get_bd_ports in_data_29_address0]
connect_bd_net [get_bd_pins hls_inst/in_data_29_address1] [get_bd_ports in_data_29_address1]
connect_bd_net [get_bd_pins hls_inst/in_data_29_ce0] [get_bd_ports in_data_29_ce0]
connect_bd_net [get_bd_pins hls_inst/in_data_29_ce1] [get_bd_ports in_data_29_ce1]
connect_bd_net [get_bd_pins hls_inst/in_data_29_d0] [get_bd_ports in_data_29_d0]
connect_bd_net [get_bd_pins hls_inst/in_data_29_d1] [get_bd_ports in_data_29_d1]
connect_bd_net [get_bd_pins hls_inst/in_data_29_we0] [get_bd_ports in_data_29_we0]
connect_bd_net [get_bd_pins hls_inst/in_data_29_we1] [get_bd_ports in_data_29_we1]
connect_bd_net [get_bd_pins hls_inst/in_data_2_address0] [get_bd_ports in_data_2_address0]
connect_bd_net [get_bd_pins hls_inst/in_data_2_address1] [get_bd_ports in_data_2_address1]
connect_bd_net [get_bd_pins hls_inst/in_data_2_ce0] [get_bd_ports in_data_2_ce0]
connect_bd_net [get_bd_pins hls_inst/in_data_2_ce1] [get_bd_ports in_data_2_ce1]
connect_bd_net [get_bd_pins hls_inst/in_data_30_address0] [get_bd_ports in_data_30_address0]
connect_bd_net [get_bd_pins hls_inst/in_data_30_address1] [get_bd_ports in_data_30_address1]
connect_bd_net [get_bd_pins hls_inst/in_data_30_ce0] [get_bd_ports in_data_30_ce0]
connect_bd_net [get_bd_pins hls_inst/in_data_30_ce1] [get_bd_ports in_data_30_ce1]
connect_bd_net [get_bd_pins hls_inst/in_data_30_d0] [get_bd_ports in_data_30_d0]
connect_bd_net [get_bd_pins hls_inst/in_data_30_d1] [get_bd_ports in_data_30_d1]
connect_bd_net [get_bd_pins hls_inst/in_data_30_we0] [get_bd_ports in_data_30_we0]
connect_bd_net [get_bd_pins hls_inst/in_data_30_we1] [get_bd_ports in_data_30_we1]
connect_bd_net [get_bd_pins hls_inst/in_data_31_address0] [get_bd_ports in_data_31_address0]
connect_bd_net [get_bd_pins hls_inst/in_data_31_address1] [get_bd_ports in_data_31_address1]
connect_bd_net [get_bd_pins hls_inst/in_data_31_ce0] [get_bd_ports in_data_31_ce0]
connect_bd_net [get_bd_pins hls_inst/in_data_31_ce1] [get_bd_ports in_data_31_ce1]
connect_bd_net [get_bd_pins hls_inst/in_data_31_d0] [get_bd_ports in_data_31_d0]
connect_bd_net [get_bd_pins hls_inst/in_data_31_d1] [get_bd_ports in_data_31_d1]
connect_bd_net [get_bd_pins hls_inst/in_data_31_we0] [get_bd_ports in_data_31_we0]
connect_bd_net [get_bd_pins hls_inst/in_data_31_we1] [get_bd_ports in_data_31_we1]
connect_bd_net [get_bd_pins hls_inst/in_data_3_address0] [get_bd_ports in_data_3_address0]
connect_bd_net [get_bd_pins hls_inst/in_data_3_address1] [get_bd_ports in_data_3_address1]
connect_bd_net [get_bd_pins hls_inst/in_data_3_ce0] [get_bd_ports in_data_3_ce0]
connect_bd_net [get_bd_pins hls_inst/in_data_3_ce1] [get_bd_ports in_data_3_ce1]
connect_bd_net [get_bd_pins hls_inst/in_data_3_d0] [get_bd_ports in_data_3_d0]
connect_bd_net [get_bd_pins hls_inst/in_data_3_d1] [get_bd_ports in_data_3_d1]
connect_bd_net [get_bd_pins hls_inst/in_data_3_we0] [get_bd_ports in_data_3_we0]
connect_bd_net [get_bd_pins hls_inst/in_data_3_we1] [get_bd_ports in_data_3_we1]
connect_bd_net [get_bd_pins hls_inst/in_data_4_address0] [get_bd_ports in_data_4_address0]
connect_bd_net [get_bd_pins hls_inst/in_data_4_address1] [get_bd_ports in_data_4_address1]
connect_bd_net [get_bd_pins hls_inst/in_data_4_ce0] [get_bd_ports in_data_4_ce0]
connect_bd_net [get_bd_pins hls_inst/in_data_5_address0] [get_bd_ports in_data_5_address0]
connect_bd_net [get_bd_pins hls_inst/in_data_5_address1] [get_bd_ports in_data_5_address1]
connect_bd_net [get_bd_pins hls_inst/in_data_5_ce0] [get_bd_ports in_data_5_ce0]
connect_bd_net [get_bd_pins hls_inst/in_data_5_ce1] [get_bd_ports in_data_5_ce1]
connect_bd_net [get_bd_pins hls_inst/in_data_5_d0] [get_bd_ports in_data_5_d0]
connect_bd_net [get_bd_pins hls_inst/in_data_5_d1] [get_bd_ports in_data_5_d1]
connect_bd_net [get_bd_pins hls_inst/in_data_5_we0] [get_bd_ports in_data_5_we0]
connect_bd_net [get_bd_pins hls_inst/in_data_5_we1] [get_bd_ports in_data_5_we1]
connect_bd_net [get_bd_pins hls_inst/in_data_6_address0] [get_bd_ports in_data_6_address0]
connect_bd_net [get_bd_pins hls_inst/in_data_6_address1] [get_bd_ports in_data_6_address1]
connect_bd_net [get_bd_pins hls_inst/in_data_6_ce0] [get_bd_ports in_data_6_ce0]
connect_bd_net [get_bd_pins hls_inst/in_data_6_ce1] [get_bd_ports in_data_6_ce1]
connect_bd_net [get_bd_pins hls_inst/in_data_7_address0] [get_bd_ports in_data_7_address0]
connect_bd_net [get_bd_pins hls_inst/in_data_7_address1] [get_bd_ports in_data_7_address1]
connect_bd_net [get_bd_pins hls_inst/in_data_7_ce0] [get_bd_ports in_data_7_ce0]
connect_bd_net [get_bd_pins hls_inst/in_data_7_ce1] [get_bd_ports in_data_7_ce1]
connect_bd_net [get_bd_pins hls_inst/in_data_7_d0] [get_bd_ports in_data_7_d0]
connect_bd_net [get_bd_pins hls_inst/in_data_7_d1] [get_bd_ports in_data_7_d1]
connect_bd_net [get_bd_pins hls_inst/in_data_7_we0] [get_bd_ports in_data_7_we0]
connect_bd_net [get_bd_pins hls_inst/in_data_7_we1] [get_bd_ports in_data_7_we1]
connect_bd_net [get_bd_pins hls_inst/in_data_8_address0] [get_bd_ports in_data_8_address0]
connect_bd_net [get_bd_pins hls_inst/in_data_8_address1] [get_bd_ports in_data_8_address1]
connect_bd_net [get_bd_pins hls_inst/in_data_8_ce0] [get_bd_ports in_data_8_ce0]
connect_bd_net [get_bd_pins hls_inst/in_data_8_ce1] [get_bd_ports in_data_8_ce1]
connect_bd_net [get_bd_pins hls_inst/in_data_9_address0] [get_bd_ports in_data_9_address0]
connect_bd_net [get_bd_pins hls_inst/in_data_9_address1] [get_bd_ports in_data_9_address1]
connect_bd_net [get_bd_pins hls_inst/in_data_9_ce0] [get_bd_ports in_data_9_ce0]
connect_bd_net [get_bd_pins hls_inst/in_data_9_ce1] [get_bd_ports in_data_9_ce1]
connect_bd_net [get_bd_pins hls_inst/in_data_9_d0] [get_bd_ports in_data_9_d0]
connect_bd_net [get_bd_pins hls_inst/in_data_9_d1] [get_bd_ports in_data_9_d1]
connect_bd_net [get_bd_pins hls_inst/in_data_9_we0] [get_bd_ports in_data_9_we0]
connect_bd_net [get_bd_pins hls_inst/in_data_9_we1] [get_bd_ports in_data_9_we1]
connect_bd_net [get_bd_pins hls_inst/in_scalar_address0] [get_bd_ports in_scalar_address0]
connect_bd_net [get_bd_pins hls_inst/in_scalar_address1] [get_bd_ports in_scalar_address1]
connect_bd_net [get_bd_pins hls_inst/in_scalar_ce0] [get_bd_ports in_scalar_ce0]
connect_bd_net [get_bd_pins hls_inst/in_scalar_ce1] [get_bd_ports in_scalar_ce1]
connect_bd_net [get_bd_pins hls_inst/out_data_0] [get_bd_ports out_data_0]
connect_bd_net [get_bd_pins hls_inst/out_data_1] [get_bd_ports out_data_1]
connect_bd_net [get_bd_pins hls_inst/out_data_2] [get_bd_ports out_data_2]
connect_bd_net [get_bd_pins hls_inst/out_data_3] [get_bd_ports out_data_3]
connect_bd_net -net in_data_0_q0_0_1 [get_bd_ports in_data_0_q0] [get_bd_pins hls_inst/in_data_0_q0]
connect_bd_net -net in_data_0_q1_0_1 [get_bd_ports in_data_0_q1] [get_bd_pins hls_inst/in_data_0_q1]
connect_bd_net -net in_data_10_q0_0_1 [get_bd_ports in_data_10_q0] [get_bd_pins hls_inst/in_data_10_q0]
connect_bd_net -net in_data_10_q1_0_1 [get_bd_ports in_data_10_q1] [get_bd_pins hls_inst/in_data_10_q1]
connect_bd_net -net in_data_11_q0_0_1 [get_bd_ports in_data_11_q0] [get_bd_pins hls_inst/in_data_11_q0]
connect_bd_net -net in_data_11_q1_0_1 [get_bd_ports in_data_11_q1] [get_bd_pins hls_inst/in_data_11_q1]
connect_bd_net -net in_data_12_q0_0_1 [get_bd_ports in_data_12_q0] [get_bd_pins hls_inst/in_data_12_q0]
connect_bd_net -net in_data_12_q1_0_1 [get_bd_ports in_data_12_q1] [get_bd_pins hls_inst/in_data_12_q1]
connect_bd_net -net in_data_13_q0_0_1 [get_bd_ports in_data_13_q0] [get_bd_pins hls_inst/in_data_13_q0]
connect_bd_net -net in_data_13_q1_0_1 [get_bd_ports in_data_13_q1] [get_bd_pins hls_inst/in_data_13_q1]
connect_bd_net -net in_data_14_q0_0_1 [get_bd_ports in_data_14_q0] [get_bd_pins hls_inst/in_data_14_q0]
connect_bd_net -net in_data_14_q1_0_1 [get_bd_ports in_data_14_q1] [get_bd_pins hls_inst/in_data_14_q1]
connect_bd_net -net in_data_15_q0_0_1 [get_bd_ports in_data_15_q0] [get_bd_pins hls_inst/in_data_15_q0]
connect_bd_net -net in_data_15_q1_0_1 [get_bd_ports in_data_15_q1] [get_bd_pins hls_inst/in_data_15_q1]
connect_bd_net -net in_data_16_q0_0_1 [get_bd_ports in_data_16_q0] [get_bd_pins hls_inst/in_data_16_q0]
connect_bd_net -net in_data_17_q0_0_1 [get_bd_ports in_data_17_q0] [get_bd_pins hls_inst/in_data_17_q0]
connect_bd_net -net in_data_17_q1_0_1 [get_bd_ports in_data_17_q1] [get_bd_pins hls_inst/in_data_17_q1]
connect_bd_net -net in_data_18_q0_0_1 [get_bd_ports in_data_18_q0] [get_bd_pins hls_inst/in_data_18_q0]
connect_bd_net -net in_data_18_q1_0_1 [get_bd_ports in_data_18_q1] [get_bd_pins hls_inst/in_data_18_q1]
connect_bd_net -net in_data_19_q0_0_1 [get_bd_ports in_data_19_q0] [get_bd_pins hls_inst/in_data_19_q0]
connect_bd_net -net in_data_19_q1_0_1 [get_bd_ports in_data_19_q1] [get_bd_pins hls_inst/in_data_19_q1]
connect_bd_net -net in_data_1_q0_0_1 [get_bd_ports in_data_1_q0] [get_bd_pins hls_inst/in_data_1_q0]
connect_bd_net -net in_data_1_q1_0_1 [get_bd_ports in_data_1_q1] [get_bd_pins hls_inst/in_data_1_q1]
connect_bd_net -net in_data_20_q0_0_1 [get_bd_ports in_data_20_q0] [get_bd_pins hls_inst/in_data_20_q0]
connect_bd_net -net in_data_20_q1_0_1 [get_bd_ports in_data_20_q1] [get_bd_pins hls_inst/in_data_20_q1]
connect_bd_net -net in_data_21_q0_0_1 [get_bd_ports in_data_21_q0] [get_bd_pins hls_inst/in_data_21_q0]
connect_bd_net -net in_data_21_q1_0_1 [get_bd_ports in_data_21_q1] [get_bd_pins hls_inst/in_data_21_q1]
connect_bd_net -net in_data_22_q0_0_1 [get_bd_ports in_data_22_q0] [get_bd_pins hls_inst/in_data_22_q0]
connect_bd_net -net in_data_22_q1_0_1 [get_bd_ports in_data_22_q1] [get_bd_pins hls_inst/in_data_22_q1]
connect_bd_net -net in_data_23_q0_0_1 [get_bd_ports in_data_23_q0] [get_bd_pins hls_inst/in_data_23_q0]
connect_bd_net -net in_data_23_q1_0_1 [get_bd_ports in_data_23_q1] [get_bd_pins hls_inst/in_data_23_q1]
connect_bd_net -net in_data_24_q0_0_1 [get_bd_ports in_data_24_q0] [get_bd_pins hls_inst/in_data_24_q0]
connect_bd_net -net in_data_24_q1_0_1 [get_bd_ports in_data_24_q1] [get_bd_pins hls_inst/in_data_24_q1]
connect_bd_net -net in_data_25_q0_0_1 [get_bd_ports in_data_25_q0] [get_bd_pins hls_inst/in_data_25_q0]
connect_bd_net -net in_data_25_q1_0_1 [get_bd_ports in_data_25_q1] [get_bd_pins hls_inst/in_data_25_q1]
connect_bd_net -net in_data_26_q0_0_1 [get_bd_ports in_data_26_q0] [get_bd_pins hls_inst/in_data_26_q0]
connect_bd_net -net in_data_26_q1_0_1 [get_bd_ports in_data_26_q1] [get_bd_pins hls_inst/in_data_26_q1]
connect_bd_net -net in_data_27_q0_0_1 [get_bd_ports in_data_27_q0] [get_bd_pins hls_inst/in_data_27_q0]
connect_bd_net -net in_data_27_q1_0_1 [get_bd_ports in_data_27_q1] [get_bd_pins hls_inst/in_data_27_q1]
connect_bd_net -net in_data_28_q0_0_1 [get_bd_ports in_data_28_q0] [get_bd_pins hls_inst/in_data_28_q0]
connect_bd_net -net in_data_28_q1_0_1 [get_bd_ports in_data_28_q1] [get_bd_pins hls_inst/in_data_28_q1]
connect_bd_net -net in_data_29_q0_0_1 [get_bd_ports in_data_29_q0] [get_bd_pins hls_inst/in_data_29_q0]
connect_bd_net -net in_data_29_q1_0_1 [get_bd_ports in_data_29_q1] [get_bd_pins hls_inst/in_data_29_q1]
connect_bd_net -net in_data_2_q0_0_1 [get_bd_ports in_data_2_q0] [get_bd_pins hls_inst/in_data_2_q0]
connect_bd_net -net in_data_2_q1_0_1 [get_bd_ports in_data_2_q1] [get_bd_pins hls_inst/in_data_2_q1]
connect_bd_net -net in_data_30_q0_0_1 [get_bd_ports in_data_30_q0] [get_bd_pins hls_inst/in_data_30_q0]
connect_bd_net -net in_data_30_q1_0_1 [get_bd_ports in_data_30_q1] [get_bd_pins hls_inst/in_data_30_q1]
connect_bd_net -net in_data_31_q0_0_1 [get_bd_ports in_data_31_q0] [get_bd_pins hls_inst/in_data_31_q0]
connect_bd_net -net in_data_31_q1_0_1 [get_bd_ports in_data_31_q1] [get_bd_pins hls_inst/in_data_31_q1]
connect_bd_net -net in_data_3_q0_0_1 [get_bd_ports in_data_3_q0] [get_bd_pins hls_inst/in_data_3_q0]
connect_bd_net -net in_data_3_q1_0_1 [get_bd_ports in_data_3_q1] [get_bd_pins hls_inst/in_data_3_q1]
connect_bd_net -net in_data_4_q0_0_1 [get_bd_ports in_data_4_q0] [get_bd_pins hls_inst/in_data_4_q0]
connect_bd_net -net in_data_4_q1_0_1 [get_bd_ports in_data_4_q1] [get_bd_pins hls_inst/in_data_4_q1]
connect_bd_net -net in_data_5_q0_0_1 [get_bd_ports in_data_5_q0] [get_bd_pins hls_inst/in_data_5_q0]
connect_bd_net -net in_data_5_q1_0_1 [get_bd_ports in_data_5_q1] [get_bd_pins hls_inst/in_data_5_q1]
connect_bd_net -net in_data_6_q0_0_1 [get_bd_ports in_data_6_q0] [get_bd_pins hls_inst/in_data_6_q0]
connect_bd_net -net in_data_6_q1_0_1 [get_bd_ports in_data_6_q1] [get_bd_pins hls_inst/in_data_6_q1]
connect_bd_net -net in_data_7_q0_0_1 [get_bd_ports in_data_7_q0] [get_bd_pins hls_inst/in_data_7_q0]
connect_bd_net -net in_data_7_q1_0_1 [get_bd_ports in_data_7_q1] [get_bd_pins hls_inst/in_data_7_q1]
connect_bd_net -net in_data_8_q0_0_1 [get_bd_ports in_data_8_q0] [get_bd_pins hls_inst/in_data_8_q0]
connect_bd_net -net in_data_8_q1_0_1 [get_bd_ports in_data_8_q1] [get_bd_pins hls_inst/in_data_8_q1]
connect_bd_net -net in_data_9_q0_0_1 [get_bd_ports in_data_9_q0] [get_bd_pins hls_inst/in_data_9_q0]
connect_bd_net -net in_data_9_q1_0_1 [get_bd_ports in_data_9_q1] [get_bd_pins hls_inst/in_data_9_q1]
connect_bd_net -net in_scalar_q0_0_1 [get_bd_ports in_scalar_q0] [get_bd_pins hls_inst/in_scalar_q0]
connect_bd_net -net in_scalar_q1_0_1 [get_bd_ports in_scalar_q1] [get_bd_pins hls_inst/in_scalar_q1]

validate_bd_design
save_bd_design
